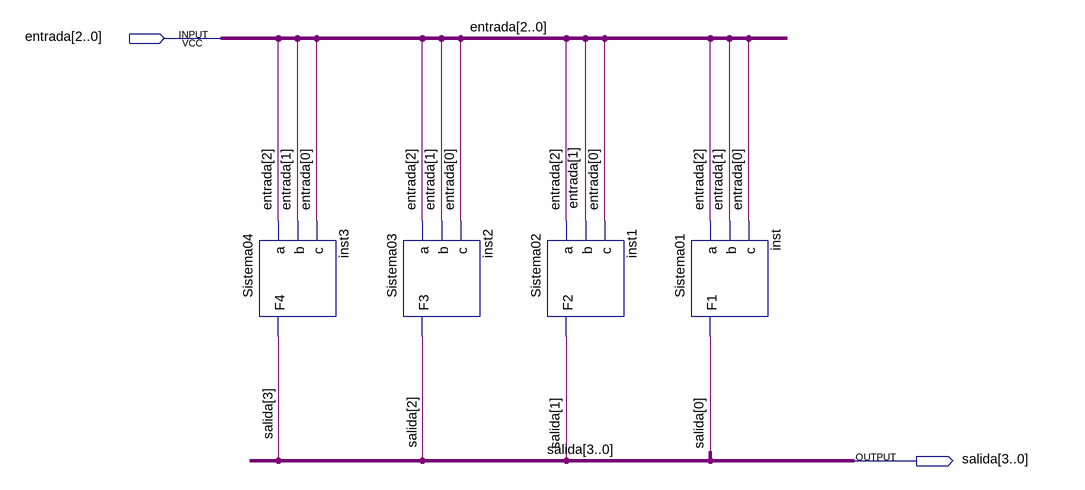
[diagram p0: schematic sheet]
// Quartus schematic Completo.bdf as structural Verilog: 4 symbols, 2 pins
module Completo (
  input  [2:0] entrada,
  output [3:0] salida
);

  Sistema04 inst3 (.a(entrada[2]), .b(entrada[1]), .c(entrada[0]), .F4(salida[3]));
  Sistema03 inst2 (.a(entrada[2]), .b(entrada[1]), .c(entrada[0]), .F3(salida[2]));
  Sistema02 inst1 (.a(entrada[2]), .b(entrada[1]), .c(entrada[0]), .F2(salida[1]));
  Sistema01 inst (.a(entrada[2]), .b(entrada[1]), .c(entrada[0]), .F1(salida[0]));
endmodule
